# EAGLE design AST1044 (EAGLE 6.3)
DATABASE: ./../../../../../Components/TinyCircuits_Part_Database.txt
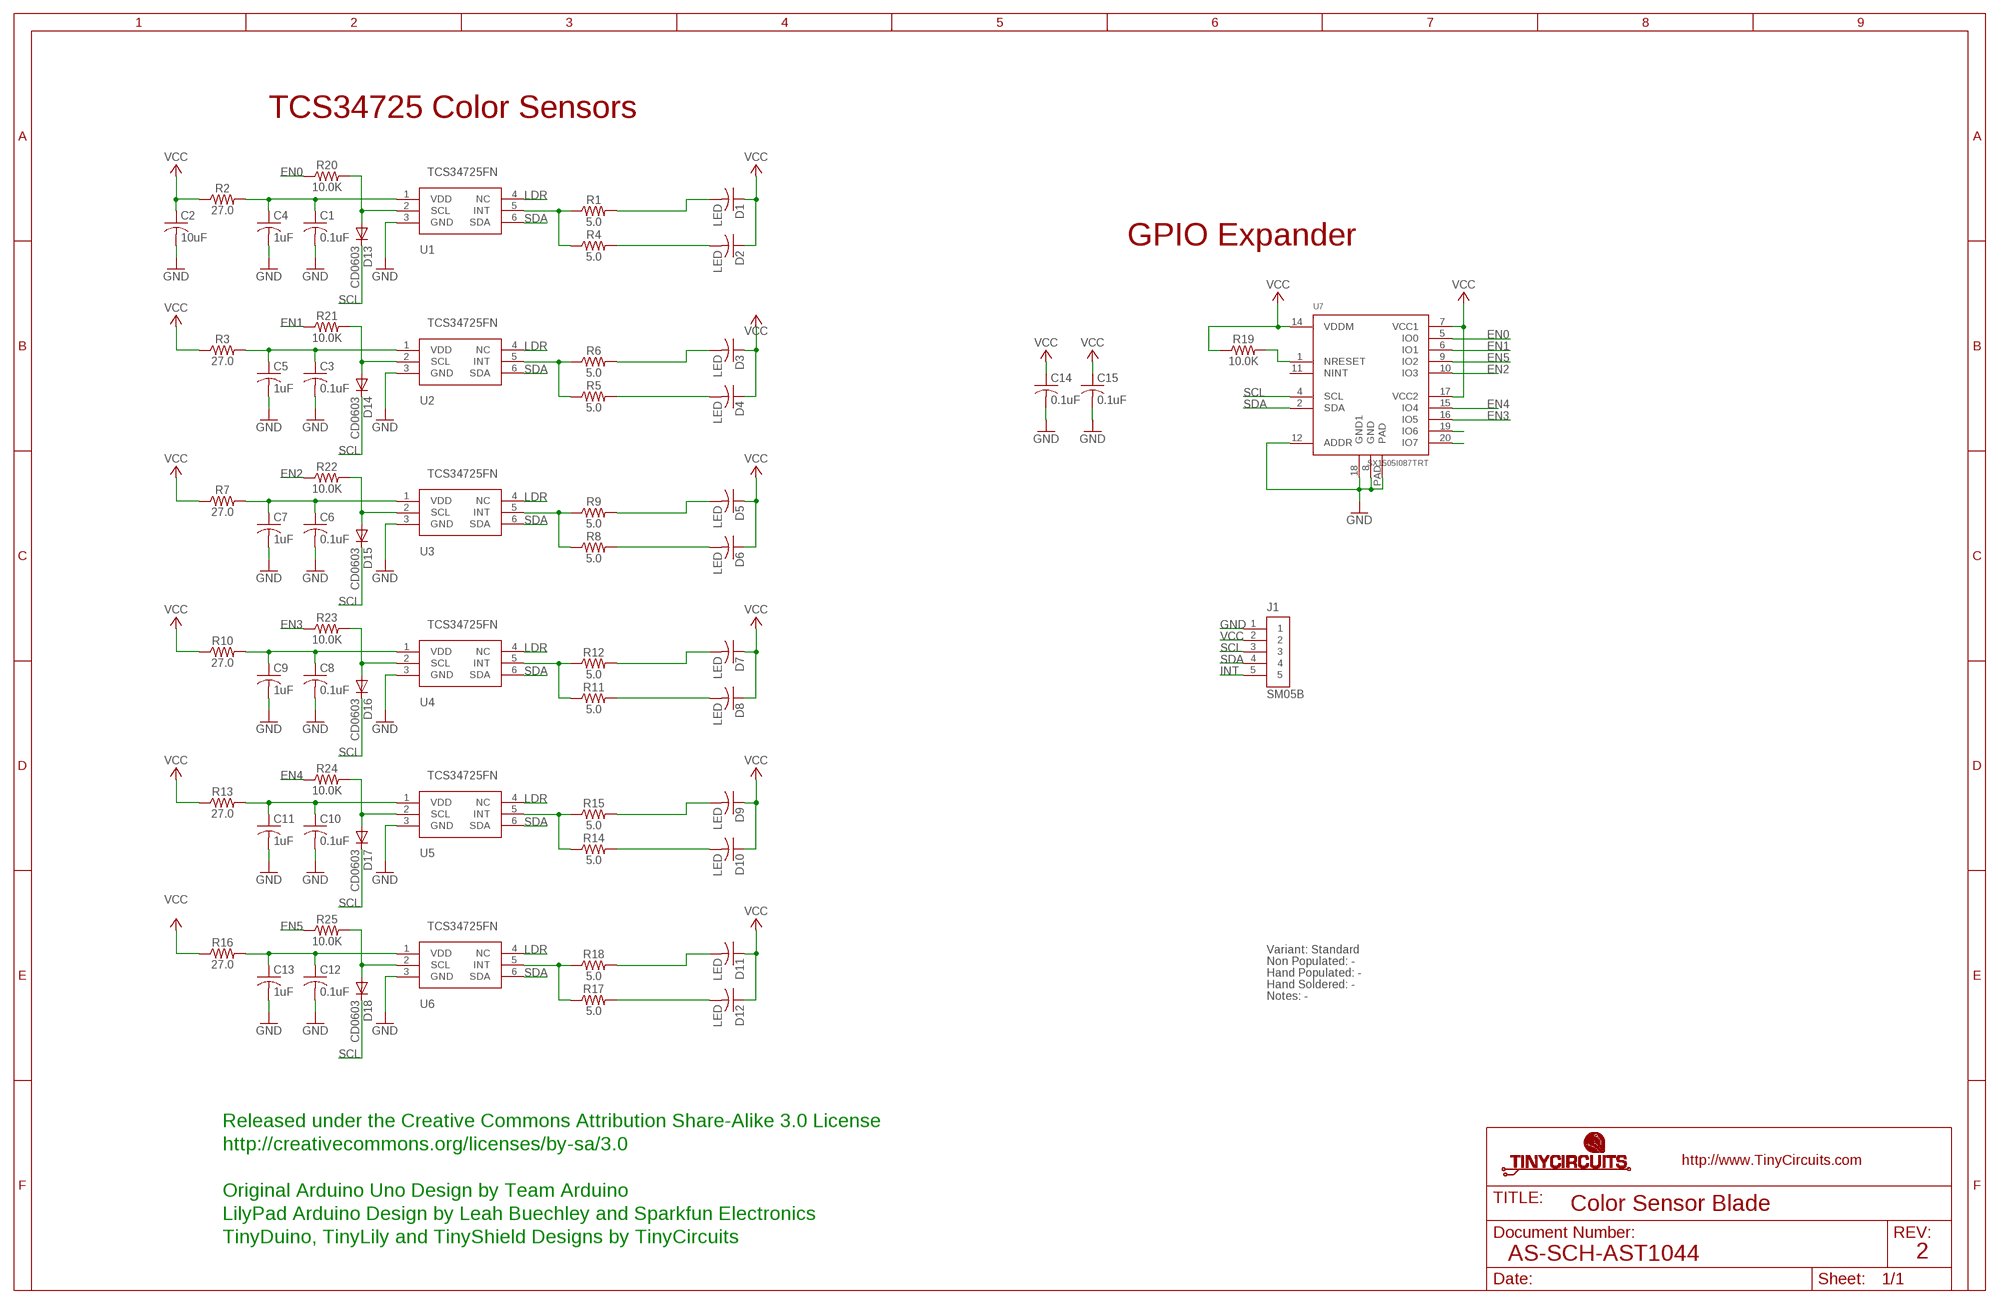
[diagram p0: schematic, sheet 1]

## Parts
C1  0.1uF  AS-ITM-00008  [C0402]
C2  10uF  AS-ITM-00002  [C0603]
C3  0.1uF  AS-ITM-00008  [C0402]
C4  1uF  AS-ITM-00105  [C0402]
C5  1uF  AS-ITM-00105  [C0402]
C6  0.1uF  AS-ITM-00008  [C0402]
C7  1uF  AS-ITM-00105  [C0402]
C8  0.1uF  AS-ITM-00008  [C0402]
C9  1uF  AS-ITM-00105  [C0402]
C10  0.1uF  AS-ITM-00008  [C0402]
C11  1uF  AS-ITM-00105  [C0402]
C12  0.1uF  AS-ITM-00008  [C0402]
C13  1uF  AS-ITM-00105  [C0402]
C14  0.1uF  AS-ITM-00008  [C0402]
C15  0.1uF  AS-ITM-00008  [C0402]
D1  LED  AS-ITM-00049  [C1206]
D2  LED  AS-ITM-00049  [C1206]
D3  LED  AS-ITM-00049  [C1206]
D4  LED  AS-ITM-00049  [C1206]
D5  LED  AS-ITM-00049  [C1206]
D6  LED  AS-ITM-00049  [C1206]
D7  LED  AS-ITM-00049  [C1206]
D8  LED  AS-ITM-00049  [C1206]
D9  LED  AS-ITM-00049  [C1206]
D10  LED  AS-ITM-00049  [C1206]
D11  LED  AS-ITM-00049  [C1206]
D12  LED  AS-ITM-00049  [C1206]
D13  CD0603  AS-ITM-00009  [0603]
D14  CD0603  AS-ITM-00009  [0603]
D15  CD0603  AS-ITM-00009  [0603]
D16  CD0603  AS-ITM-00009  [0603]
D17  CD0603  AS-ITM-00009  [0603]
D18  CD0603  AS-ITM-00009  [0603]
J1  SM05B  AS-ITM-00340EDGE  [JST_SH_5X1_EDGE]
R1  5.0  AS-ITM-00289  [0402]
R2  27.0  AS-ITM-00240  [0402]
R3  27.0  AS-ITM-00240  [0402]
R4  5.0  AS-ITM-00289  [0402]
R5  5.0  AS-ITM-00289  [0402]
R6  5.0  AS-ITM-00289  [0402]
R7  27.0  AS-ITM-00240  [0402]
R8  5.0  AS-ITM-00289  [0402]
R9  5.0  AS-ITM-00289  [0402]
R10  27.0  AS-ITM-00240  [0402]
R11  5.0  AS-ITM-00289  [0402]
R12  5.0  AS-ITM-00289  [0402]
R13  27.0  AS-ITM-00240  [0402]
R14  5.0  AS-ITM-00289  [0402]
R15  5.0  AS-ITM-00289  [0402]
R16  27.0  AS-ITM-00240  [0402]
R17  5.0  AS-ITM-00289  [0402]
R18  5.0  AS-ITM-00289  [0402]
R19  10.0K  AS-ITM-00032  [0402]
R20  10.0K  AS-ITM-00032  [0402]
R21  10.0K  AS-ITM-00032  [0402]
R22  10.0K  AS-ITM-00032  [0402]
R23  10.0K  AS-ITM-00032  [0402]
R24  10.0K  AS-ITM-00032  [0402]
R25  10.0K  AS-ITM-00032  [0402]
U1  TCS34725FN  AS-ITM-00140  [TSL2572]
U2  TCS34725FN  AS-ITM-00140  [TSL2572]
U3  TCS34725FN  AS-ITM-00140  [TSL2572]
U4  TCS34725FN  AS-ITM-00140  [TSL2572]
U5  TCS34725FN  AS-ITM-00140  [TSL2572]
U6  TCS34725FN  AS-ITM-00140  [TSL2572]
U7  SX1505I087TRT  AS-ITM-00203  [QFN-UT20]

## Nets
EN0: R20.1 U7.5(IO0)
EN1: R21.1 U7.6(IO1)
EN2: R22.1 U7.10(IO3)
EN3: R23.1 U7.16(IO5)
EN4: R24.1 U7.15(IO4)
EN5: R25.1 U7.9(IO2)
GND: C1.2 C2.2 C3.2 C4.2 C5.2 C6.2 C7.2 C8.2 C9.2 C10.2 C11.2 C12.2 C13.2 C14.2 C15.2 J1.1 U1.3(GND) U2.3(GND) U3.3(GND) U4.3(GND) U5.3(GND) U6.3(GND) U7.8(GND) U7.12(ADDR) U7.18(GND1) U7.PAD
INT: J1.5
LDR: U1.4(NC) U2.4(NC) U3.4(NC) U4.4(NC) U5.4(NC) U6.4(NC)
N$1: R1.1 R4.1 U1.5(INT)
N$2: C1.1 C4.1 R2.2 U1.1(VDD)
N$3: D2.2 R4.2
N$4: D1.2 R1.2
N$5: C3.1 C5.1 R3.2 U2.1(VDD)
N$6: R5.1 R6.1 U2.5(INT)
N$7: D4.2 R5.2
N$8: D3.2 R6.2
N$10: C6.1 C7.1 R7.2 U3.1(VDD)
N$11: R8.1 R9.1 U3.5(INT)
N$12: D6.2 R8.2
N$14: D5.2 R9.2
N$16: C8.1 C9.1 R10.2 U4.1(VDD)
N$17: R11.1 R12.1 U4.5(INT)
N$18: D8.2 R11.2
N$19: D7.2 R12.2
N$21: C10.1 C11.1 R13.2 U5.1(VDD)
N$22: R14.1 R15.1 U5.5(INT)
N$23: D10.2 R14.2
N$24: D9.2 R15.2
N$26: C12.1 C13.1 R16.2 U6.1(VDD)
N$27: R17.1 R18.1 U6.5(INT)
N$28: D12.2 R17.2
N$29: D11.2 R18.2
N$31: D13.A R20.2 U1.2(SCL)
N$32: D14.A R21.2 U2.2(SCL)
N$33: D15.A R22.2 U3.2(SCL)
N$34: D16.A R23.2 U4.2(SCL)
N$35: R19.2 U7.1(NRESET)
N$38: D17.A R24.2 U5.2(SCL)
N$40: D18.A R25.2 U6.2(SCL)
N$41: U7.19(IO6)
N$42: U7.20(IO7)
SCL: D13.C D14.C D15.C D16.C D17.C D18.C J1.3 U7.4(SCL)
SDA: J1.4 U1.6(SDA) U2.6(SDA) U3.6(SDA) U4.6(SDA) U5.6(SDA) U6.6(SDA) U7.2(SDA)
VCC: C2.1 C14.1 C15.1 D1.1 D2.1 D3.1 D4.1 D5.1 D6.1 D7.1 D8.1 D9.1 D10.1 D11.1 D12.1 J1.2 R2.1 R3.1 R7.1 R10.1 R13.1 R16.1 R19.1 U7.7(VCC1) U7.14(VDDM) U7.17(VCC2)
Unconnected: U7.11(NINT)

## Notes on the sheet
- TCS34725 Color Sensors
- GPIO Expander
- Variant: Standard
- Non Populated: -
- Hand Populated: -
- Hand Soldered: -
- Notes: -
- Released under the Creative Commons Attribution Share-Alike 3.0 License
- http://creativecommons.org/licenses/by-sa/3.0
- Original Arduino Uno Design by Team Arduino
- Color Sensor Blade
- LilyPad Arduino Design by Leah Buechley and Sparkfun Electronics
- TinyDuino, TinyLily and TinyShield Designs by TinyCircuits
- AS-SCH-AST1044 | 2

## Library data of the parts
C1 C3 C6 C8 C10 C12 C14 C15 = tinycircuits:AS-ITM-00008: CAP CER 0.1UF 16V 10% X5R 0402; PARTNO: AS-ITM-00008
C2 = tinycircuits:AS-ITM-00002: CAP CER 10UF 10V 20% X5R 0603; PARTNO: AS-ITM-00002
C4 C5 C7 C9 C11 C13 = tinycircuits:AS-ITM-00105: CAP CER 1UF 6.3V 10% X5R 0402; PARTNO: AS-ITM-00105
D1-D12 = tinycircuits:AS-ITM-00049: CAP CER 47UF 6.3V 20% X6S 1206; PARTNO: AS-ITM-00049; VALUE: 47uF
D13-D18 = tinycircuits:AS-ITM-00009: Diodes (General Purpose, Power, Switching) IO=150mA VR=75V HIGH SPEED; PARTNO: AS-ITM-00009; PNPROTATION: 0
J1 = tinycircuits:AS-ITM-00340: CONN HEADER SH 5POS SIDE 1MM TIN; PARTNO: AS-ITM-00340; PNPROTATION: 180
R1 R4-R6 R8 R9 R11 R12 R14 R15 R17 R18 = tinycircuits:AS-ITM-00289: RES SMD 5.0K OHM 1% 1/16W 0402; PARTNO: AS-ITM-00289; VALUE: 5K
R2 R3 R7 R10 R13 R16 = tinycircuits:AS-ITM-00240: RES 27 OHM 1/16W 5% 0402 SMD; PARTNO: AS-ITM-00240
R19-R25 = tinycircuits:AS-ITM-00032: RES 10.0K OHM 1/16W 1% 0402 SMD; PARTNO: AS-ITM-00032
U1-U6 = tinycircuits:AS-ITM-00140: TCS3472 Color Sensor; PARTNO: AS-ITM-00140
U7 = tinycircuits:AS-ITM-00203: IC GPIO EXP I2C 8CH 20UTQFN; PARTNO: AS-ITM-00203

## Net classes
2 gnd: width 0.305 mm, drill 0.559 mm, clearance 0.254 mm

## Board
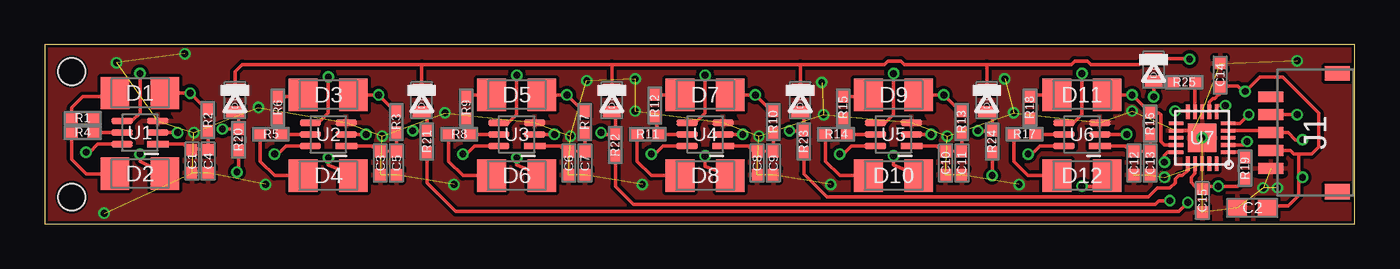
[diagram p1: board, top side]
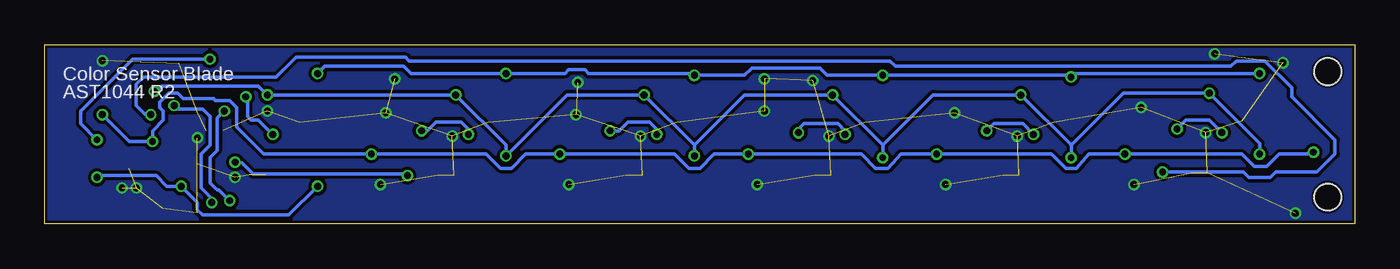
[diagram p2: board, bottom side, seen from below]

Size 73 x 10 mm. Coordinates in mm from the lower left corner, seen from the top.
Outline: 0,0 73,0 73,10 0,10 0,0
Copper layers (1*16): Top 0.035mm / dielectric 1.5mm / Bottom 0.035mm
Design rules "default *": minimum track width 8mil, minimum drill 15mil, track to track 7mil, track to pad 7mil, pad to pad 7mil, via to via 7mil, smd to smd 7mil, copper to edge 6mil, drill to drill 8mil, minimum pad ring 8mil, minimum via ring 5mil, stop-mask expansion 4mil, vias tented up to drill 25mil, thermal gap 10mil
Holes 1.5 mm at 1.5,8.5 1.5,1.5

### Footprints (pad centres in the part's own frame; a part is rotated, then mirrored left to right if it is on the bottom)
C0402 = smd 0.65 x 0.6: 1 -0.65,0; 2 0.65,0
C0603 = smd 1.1 x 1: 1 -0.85,0; 2 0.85,0
C1206 = smd 1.6 x 1.8: 1 -1.4,0; 2 1.4,0
0603 = smd 0.61 x 0.991: A 0.622,0; C -0.622,0
JST_SH_5X1_EDGE = smd 0.6 x 1.4: 1 -2,2.475; 2 -1,2.475; 3 0,2.475; 4 1,2.475; 5 2,2.475 | smd 0.8 x 1.4: PAD1 -3.3,-1.225; PAD2 3.3,-1.225
0402 = smd 0.65 x 0.55: 1 -0.6,0; 2 0.6,0
TSL2572 = smd 1.2 x 0.35: 1 -1,0.65; 2 -1,0; 3 -1,-0.65; 4 1,-0.65; 5 1,0; 6 1,0.65
QFN-UT20 = smd 0.8 x 0.2: 1 -1.45,0.8; 2 -1.45,0.4; 3 -1.45,0; 4 -1.45,-0.4; 5 -1.45,-0.8; 11 1.45,-0.8; 12 1.45,-0.4; 13 1.45,0; 14 1.45,0.4; 15 1.45,0.8 | smd 0.2 x 0.8: 6 -0.8,-1.45; 7 -0.4,-1.45; 8 0,-1.45; 9 0.4,-1.45; 10 0.8,-1.45; 16 0.8,1.45; 17 0.4,1.45; 18 0,1.45; 19 -0.4,1.45; 20 -0.8,1.45 | smd 1.6 x 1.6: PAD 0,0

### Placement (x,y rotation side)
C1  8.2,3.5 270 top
C2  67.3,0.9 180 top
C3  18.7,3.4 270 top
C4  9.1,3.5 270 top
C5  19.6,3.4 270 top
C6  29.2,3.4 270 top
C7  30.1,3.4 270 top
C8  39.7,3.4 270 top
C9  40.6,3.4 270 top
C10  50.2,3.4 270 top
C11  51.1,3.4 270 top
C12  60.7,3.4 270 top
C13  61.6,3.4 270 top
C14  65.5,8.31 90 top
C15  64.51,1.3 270 top
D1  5.3,7.3 180 top
D2  5.3,2.8 180 top
D3  15.8,7.2 180 top
D4  15.8,2.7 180 top
D5  26.3,7.2 180 top
D6  26.3,2.7 180 top
D7  36.8,7.2 180 top
D8  36.8,2.7 180 top
D9  47.3,7.2 180 top
D10  47.3,2.7 180 top
D11  57.8,7.2 180 top
D12  57.8,2.7 180 top
D13  10.6,6.9 270 top
D14  21,6.9 270 top
D15  31.6,6.9 270 top
D16  42.1,6.9 270 top
D17  52.5,6.9 270 top
D18  61.8,8.6 270 top
J1  70.8,5.1 90 top
R1  2.1,5.9 180 top
R2  9.1,5.8 270 top
R3  19.6,5.7 270 top
R4  2.1,5.1 180 top
R5  12.6,5 180 top
R6  13,6.5 90 top
R7  30.1,5.7 270 top
R8  23.1,5 180 top
R9  23.5,6.5 90 top
R10  40.6,5.7 270 top
R11  33.6,5 180 top
R12  34,6.6 90 top
R13  51.1,5.7 270 top
R14  44.1,5 180 top
R15  44.5,6.5 90 top
R16  61.6,5.6 270 top
R17  54.6,5 180 top
R18  54.9,6.5 90 top
R19  66.9,3.11 90 top
R20  10.8,4.7 90 top
R21  21.3,4.6 90 top
R22  31.8,4.4 90 top
R23  42.3,4.6 90 top
R24  52.8,4.6 90 top
R25  63.5,7.9 180 top
U1  5.3,5.1 180 top
U2  15.8,5 180 top
U3  26.3,5 180 top
U4  36.8,5 180 top
U5  47.3,5 180 top
U6  57.8,5 180 top
U7  64.5,4.81 180 top
U$1  [DOCFIELD-TINYCIRCUITS-PCB]  96,-10 0 top  (outside the outline)

### Tracks (layer width: path | path; a pad name or v marks a point on that pad's centre or on a via)
EN0  (via drill 0.38)
  Top 0.203: R20.1 10.8,3 v10.7,2.9 | v67.1,6.1 66.61,5.61 U7.5
  Bottom 0.203: v10.7,2.9 6.2,2.9 5.9,2.6 4.7,2.6 4.4,2.9 2.1,2.9 1.1,3.9 1.1,4.7 3.5,7.1 3.5,7.6 5,9.1 6.6,9.1 6.9,8.8 25.6,8.8 25.9,9.1 52.7,9.1 52.9,9.3 59,9.3 60.1,8.2 67.5,8.2 67.9,7.8 67.9,6.6 67.4,6.1 v67.1,6.1
EN1  (via drill 0.38)
  Top 0.203: U7.6 65.3,6.61 v65.8,6.61 | R21.1 21.3,2.3 22.9,0.7 63.2,0.7 v63.7,1.2
  Bottom 0.203: v65.8,6.61 65.59,6.4 64.2,6.4 63.8,6 63.8,4.4 64.3,3.9 64.3,2 63.8,1.5 63.8,1.4 63.7,1.3 v63.7,1.2
EN2  (via drill 0.38)
  Top 0.203: R22.1 31.8,2.1 32.8,1.1 61.9,1.1 62.1,1.3 v62.7,1.3 | U7.10 63.66,6.3 v63,6.3
  Bottom 0.203: v63,6.3 63.4,5.9 63.4,4.1 63.8,3.7 63.8,2.3 63.4,1.9 63.3,1.9 v62.7,1.3
EN3
  Top 0.203: R23.1 42.3,2.8 43.6,1.5 61.5,1.5 62,2 62.7,2 63,2.3 63,2.5 63.2,2.7 63.4,2.7 63.7,3 U7.16
EN4  (via drill 0.38)
  Top 0.203: U7.15 62.6,4.01 62.4,3.81 v62.4,3.45 | R24.1 v52.8,2.7
  Bottom 0.203: v52.8,2.7 52.9,2.8 61.4,2.8 62.01,3.41 v62.4,3.45
EN5
  Top 0.203: U7.9 R25.1
GND  (via drill 0.38)  (51 unrouted)
  Top 0.203: U7.12 64,5.21 U7.PAD
  other vias: 3.3,0.6 4,9 8.3,5.1 12.3,2.2 7.8,9.5 18.8,4.9 22.8,2.2 30.2,8 29.3,4.9 33.3,2.2 32.9,8.1 39.8,4.9 43.8,2.2 43.3,7.9 50.3,4.9 54.3,2.2 53.5,8.1 60.6,6.3 64.5,4.81 69.8,9.11 11.9,6.5 22.3,6.2 32.9,6.3 43.4,6.1 54,6.2 67.9,2.01 68.7,2.01 62.4,2.6
  pour Bottom: 0,10 73,10 73,0 0,0
  pour Top: 0,10 73,10 73,0 0,0
LDR  (via drill 0.38)
  Top 0.203: U1.4 4.85,5.75 5.3,6.2 v5.3,8.4 | v15.8,8.2 15.8,6.2 15.25,5.65 U2.4 | U3.4 25.85,5.65 26.3,6.1 v26.3,8.3 | U4.4 36.25,5.65 36.8,6.2 v36.8,8.3 | U5.4 46.85,5.65 47.3,6.1 v47.3,8.4 | U6.4 57.35,5.65 57.8,6.1 v57.8,8.4
  Bottom 0.203: v5.3,8.4 15.6,8.4 v15.8,8.2 15.9,8.3 v26.3,8.3 29.4,8.3 29.8,8.7 33.6,8.7 34,8.3 v36.8,8.3 36.9,8.4 42.7,8.4 42.9,8.6 43.8,8.6 44,8.4 v47.3,8.4 52.6,8.4 53,8.8 57.4,8.8 v57.8,8.4
N$1
  Top 0.203: U1.5 R4.1 R1.1
N$2
  Top 0.203: U1.1 7.7,4.45 C1.1 7.95,4.2 C4.1 R2.2
N$3
  Top 0.203: D2.2 2.3,2.8 1.5,3.6 R4.2
N$4
  Top 0.203: R1.2 1.5,6.5 2.1,7.1 3.7,7.1 D1.2
N$5
  Top 0.203: U2.1 18.2,4.35 C3.1 18.45,4.1 C5.1 R3.2
N$6
  Top 0.203: U2.5 R5.1 R6.1
N$7
  Top 0.203: D4.2 12.8,2.7 12,3.5 R5.2
N$8
  Top 0.203: R6.2 14.3,7.1 D3.2
N$10
  Top 0.203: U3.1 28.7,4.35 C6.1 28.95,4.1 C7.1 R7.2
N$11
  Top 0.203: U3.5 R8.1 23.5,5.2 R9.1
N$12
  Top 0.203: D6.2 23.3,2.7 22.5,3.5 R8.2
N$14
  Top 0.203: R9.2 23.6,7.2 D5.2
N$16
  Top 0.203: U4.1 39.2,4.35 C8.1 39.45,4.1 C9.1 R10.2
N$17
  Top 0.203: U4.5 R11.1 R12.1
N$18
  Top 0.203: D8.2 33.8,2.7 33,3.5 R11.2
N$19
  Top 0.203: R12.2 D7.2
N$21
  Top 0.203: U5.1 49.7,4.35 C10.1 49.95,4.1 C11.1 R13.2
N$22
  Top 0.203: U5.5 R14.1 R15.1
N$23
  Top 0.203: D10.2 44.3,2.7 43.5,3.5 R14.2
N$24
  Top 0.203: D9.2 45.8,7.1 R15.2
N$26
  Top 0.203: U6.1 60.2,4.35 C12.1 60.45,4.1 C13.1 R16.2
N$27
  Top 0.203: U6.5 R17.1 R18.1
N$28
  Top 0.203: D12.2 54.8,2.7 54,3.5 R17.2
N$29
  Top 0.203: R18.2 55,7.2 D11.2
N$31  (via drill 0.38)
  Top 0.203: U1.2 v7.4,5.1 | v9.9,5.3 R20.2 10.8,6.08 D13.A
  Bottom 0.203: v7.4,5.1 8.1,5.8 9.4,5.8 v9.9,5.3
N$32  (via drill 0.38)
  Top 0.203: U2.2 v17.9,5 | v20.5,5.2 R21.2 21.3,5.98 D14.A
  Bottom 0.203: v17.9,5 18.5,5.6 20.1,5.6 v20.5,5.2
N$33  (via drill 0.38)
  Top 0.203: U3.2 v28.4,5 | v31,5.1 31.1,5 R22.2 31.8,6.08 D15.A
  Bottom 0.203: v28.4,5 28.4,5.2 28.8,5.6 30.7,5.6 31,5.3 v31,5.1
N$34  (via drill 0.38)
  Top 0.203: U4.2 v38.9,5 | v41.5,5.2 R23.2 42.3,6.08 D16.A
  Bottom 0.203: v38.9,5 38.9,5.3 39.3,5.7 40.5,5.7 41,5.2 v41.5,5.2
N$35
  Top 0.203: U7.1 66.6,4.01 R19.2
N$38  (via drill 0.38)
  Top 0.203: U5.2 v49.4,5 | v52,5.2 R24.2 52.8,5.98 D17.A
  Bottom 0.203: v49.4,5 49.4,5.3 49.8,5.7 51.2,5.7 51.7,5.2 v52,5.2
N$40  (via drill 0.38)
  Top 0.203: U6.2 v60.3,5 | R25.2 62.88,7.98 D18.A v61.8,7.1
  Bottom 0.203: v60.3,5 61.1,5.8 61.5,5.8 61.7,6 61.7,6.8 61.9,7 v61.8,7.1
SCL  (via drill 0.38)
  Top 0.203: D13.C 10.6,8.5 11,8.9 21,8.9 | 21,8.9 31.6,8.9 | 31.6,8.9 42.1,8.9 | 42.1,8.9 46.8,8.9 47,9.1 47.7,9.1 47.9,8.9 52.5,8.9 | 52.5,8.9 57.2,8.9 57.4,9.1 58.1,9.1 58.3,8.9 61,8.9 61.32,9.22 D18.C 63.78,9.22 v63.8,9.2 | D14.C 21,8.9 | D15.C 31.6,8.9 | D16.C 42.1,8.9 | D17.C 52.5,8.9 | U7.4 68.22,5.21 J1.3 69.3,5.1 69.7,4.7 v70.1,4.7
  Bottom 0.203: v63.8,9.2 68.1,9.2 71,6.3 71,5.6 v70.1,4.7
SDA  (via drill 0.38)
  Top 0.203: v2.3,4 2.5,4 2.95,4.45 U1.6 | v12.8,3.9 13,3.9 13.45,4.35 U2.6 | v23.3,3.9 23.5,3.9 23.95,4.35 U3.6 | v33.8,3.9 34,3.9 34.45,4.35 U4.6 | v44.3,3.9 44.5,3.9 44.95,4.35 U5.6 | v54.8,3.9 55,3.9 55.45,4.35 U6.6 | U7.2 66.81,4.41 v67,4.6 | v69.8,6.1 J1.4
  Bottom 0.203: v2.3,4 2.4,3.9 4.2,3.9 4.9,3.2 5.6,3.2 6.3,3.9 v12.8,3.9 14.8,3.9 15.5,3.1 16.1,3.1 16.9,3.9 v23.3,3.9 25.3,3.9 26,3.1 26.7,3.1 27.5,3.9 v33.8,3.9 35.7,3.9 36.5,3.1 37.1,3.1 37.9,3.9 v44.3,3.9 46.2,3.9 47,3.1 47.6,3.1 48.4,3.9 v54.8,3.9 60.8,3.9 62.3,5.4 62.3,6.5 62.7,6.9 63.5,6.9 63.6,7 65.3,7 65.6,7.3 66.1,7.3 66.6,6.8 66.6,6.5 66.4,6.3 66.4,5.8 67,5.2 v67,4.6 68.3,4.6 v69.8,6.1
VCC  (via drill 0.38)
  Top 0.203: D1.1 v8.1,7.3 9,6.4 R2.1 | D2.1 5.3,3.5 v5.3,3.9 | D3.1 v18.6,7.2 19.5,6.3 R3.1 | D4.1 15.8,3.3 v15.8,3.7 | D5.1 v29.1,7.2 30,6.3 R7.1 | D6.1 26.3,3.3 v26.3,3.7 | D7.1 v39.6,7.2 40.5,6.3 R10.1 | D8.1 36.8,3.2 v36.8,3.8 | D9.1 v50.1,7.2 51,6.3 R13.1 | D10.1 47.3,3.3 v47.3,3.8 | D11.1 v60.6,7.2 R16.1 62.1,6.2 62.2,6.1 62.2,4.6 62.39,4.41 U7.14 | U7.17 64.1,2.81 63.9,2.61 63.9,2.31 64.09,2.1 v65.4,2.1 | U7.7 64.9,6.81 65.1,7.01 65.2,7.01 65.4,7.21 65.45,7.21 C14.1 65.54,7.7 66.5,7.7 66.8,7.4 v66.9,7.4 67.7,8.2 69,8.2 71,6.2 71,4.3 70.6,3.9 69.9,3.9 | 69.9,3.9 69.6,3.9 69.4,4.1 J1.2 | C2.1 68.25,1 69.3,1 69.9,1.6 69.9,2.6 | 69.9,2.6 69.9,3.9 | v70.1,2.6 69.9,2.6 | C15.1 64.36,2.1 v65.4,2.1 | D12.1 58.6,2.1 v57.8,2.1 | R19.1 66.49,2.1 v65.4,2.1
  Bottom 0.203: 36.8,4.4 v39.6,7.2 43.9,7.2 v47.3,3.8 47.3,4.4 v50.1,7.2 v60.6,7.2 61.1,7.7 66.5,7.7 66.8,7.4 v66.9,7.4 | 36.8,4.4 v36.8,3.8 | 36.8,4.4 34,7.2 v29.1,7.2 26.3,4.4 | 26.3,4.4 v26.3,3.7 | 26.3,4.4 23.5,7.2 v18.6,7.2 15.8,4.4 | 15.8,4.4 v15.8,3.7 | 15.8,4.4 12.9,7.3 v8.1,7.3 5.3,4.5 v5.3,3.9 | v70.1,2.6 70,2.7 66.8,2.7 66.2,2.1 v65.4,2.1 64.5,1.2 64.5,0.8 64.2,0.5 59.4,0.5 v57.8,2.1

### Text on the board
bPlace: Color Sensor Blade | AST1044 R2
Document: FABRICATION DRAWING | NOTES: | 1. PRINTED CIRCUIT BOARD MADE FROM NEMA GRADE FR-4 EPOXY LAMINATE | WITH 1 OUNCE COPPER PLATING AND .024 THICKNESS. | 2. ALL DIMENSIONS ARE GIVEN IN MILLIMETERS. | 3. CIRCUIT PATHS ARE FOR REFERENCE ONLY. | 4. HOLE SIZES SHOWN ARE FINISHED DIAMETERS AFTER PLATING. | 5. BOARD PLATED USING REFLOW OR SIMILAR METHOD. | 6. BOARD TO HAVE BLUE SOLDER MASK ON PLATED SURFACES USING WET FILM | 7. SILKSCREEN BOARD USING WHITE INK. | SR100 OR SR1010 EPOXY. EQUIVALENT WET OR DRY FILM MAY BE USED. | 8. THE FOLLOWING INFORMATION APPLIES TO THIS BOARD: | * 2 COPPER LAYERS | * .024 BOARD THICKNESS | * REQUIRES TOP SIDE SILKSCREEN | Released under the Creative Commons Attribution Share-Alike 3.0 License | http://creativecommons.org/licenses/by-sa/3.0 | Original Arduino Uno Design by Team Arduino | LilyPad Arduino Design by Leah Buechley and Sparkfun Electronics | TinyDuino, TinyLily and TinyShield Designs by TinyCircuits | Color Sensor Blade | AS-PCB-AST1044 | 2